# Altium schematic sheet Functional Diagram.SchDoc: Functional Diagram
size A4; ApprovedBy: LD Stanton; Author: LD Stanton; CompanyName: University of Cape Town; DrawnBy: Lawrence Stanton; Engineer: Lawrence Stanton; Organization: University of Cape Town; Address1: Department of Electrical Engineering; Address2: Rondebosch; Address3: Cape Town; Address4: South Africa 7701; DocumentNumber: 2; SheetNumber: 2; SheetTotal: 4
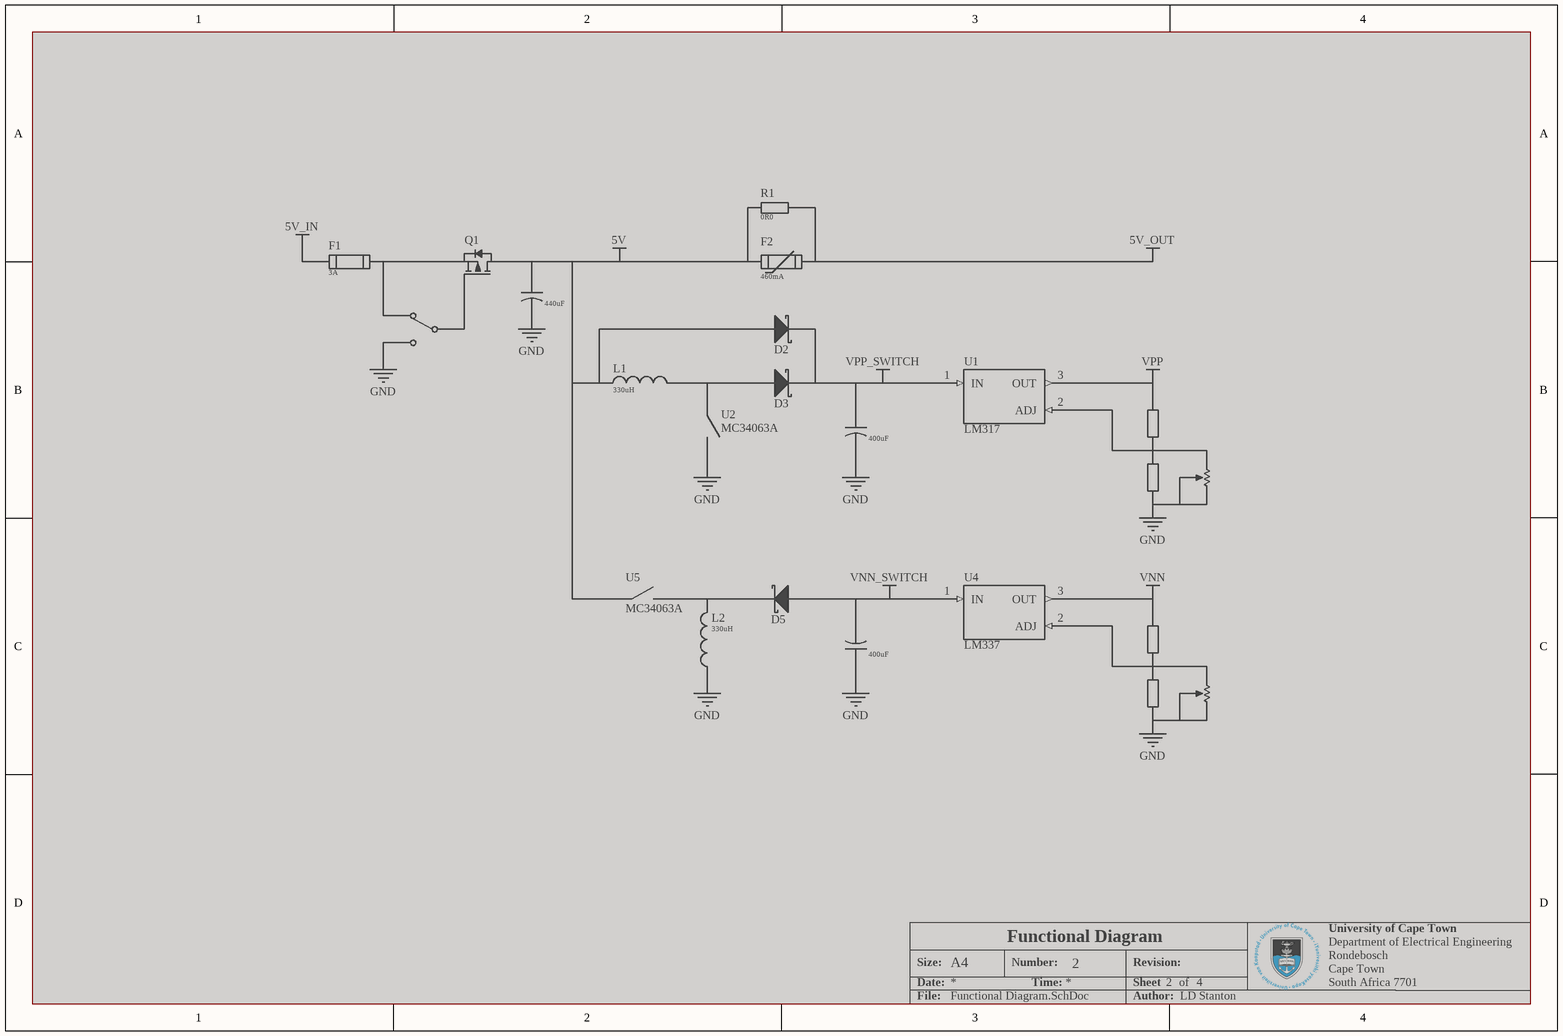
[diagram p0: Functional Diagram.SchDoc]

## Parts
(Parts that share a designator on the sheet are numbered #1, #2 ... from top to bottom, then left to right.)
C?#1  value 440uF  (hidden comment: Capacitor Polarised Illustration)  (graphical)  (masked out: inside a compile mask, not in the netlist)
C?#2  value 400uF  (hidden comment: Capacitor Polarised Illustration)  (graphical)  (masked out: inside a compile mask, not in the netlist)
C?#3  value 400uF  (hidden comment: Capacitor Polarised Illustration)  (graphical)  (masked out: inside a compile mask, not in the netlist)
D2  Schottky Diode Illustration  (value not drawn)  (graphical)  (masked out: inside a compile mask, not in the netlist)
D3  Schottky Diode Illustration  (value not drawn)  (graphical)  (masked out: inside a compile mask, not in the netlist)
D5  Schottky Diode Illustration  (value not drawn)  (graphical)  (masked out: inside a compile mask, not in the netlist)
F1  Current: 3A  (hidden comment: Fuse Illustration IEC)  (graphical)  (masked out: inside a compile mask, not in the netlist)
F2  Current: 460mA  (hidden comment: Fuse PTC Illustration IEC)  (graphical)  (masked out: inside a compile mask, not in the netlist)
L1  value 330uH  (hidden comment: Inductor Illustration)  (graphical)  (masked out: inside a compile mask, not in the netlist)
L2  value 330uH  (hidden comment: Inductor Illustration)  (graphical)  (masked out: inside a compile mask, not in the netlist)
Q1  MOSFET P-Channel Illustration  (value not drawn)  (graphical)  (masked out: inside a compile mask, not in the netlist)
R1  value 0R0  (hidden comment: Resistor Box Illustration)  (graphical)  (masked out: inside a compile mask, not in the netlist)
R?#1  Resistor Box Illustration  (value not drawn)  (graphical)  (masked out: inside a compile mask, not in the netlist)
R?#2  Resistor Box Illustration  (value not drawn)  (graphical)  (masked out: inside a compile mask, not in the netlist)
R?#3  Potentiometer Illustration  (value not drawn)  (graphical)  (masked out: inside a compile mask, not in the netlist)
R?#4  Resistor Box Illustration  (value not drawn)  (graphical)  (masked out: inside a compile mask, not in the netlist)
R?#5  Resistor Box Illustration  (value not drawn)  (graphical)  (masked out: inside a compile mask, not in the netlist)
R?#6  Potentiometer Illustration  (value not drawn)  (graphical)  (masked out: inside a compile mask, not in the netlist)
SW?  Switch Double Throw Toggling Illustration  (value not drawn)  (graphical)  (masked out: inside a compile mask, not in the netlist)
U1  LM317  (graphical)  (masked out: inside a compile mask, not in the netlist)
U2  MC34063A  (graphical)  (masked out: inside a compile mask, not in the netlist)
U4  LM337  (graphical)  (masked out: inside a compile mask, not in the netlist)
U5  MC34063A  (graphical)  (masked out: inside a compile mask, not in the netlist)

## Notes on the sheet
- Size:
- Date:
- A4
- Number:
- Time:
- Revision:
- Sheet
- of
- File:
- Author:

## Library data of the parts
C?#1-C?#3 = CMP-000004-7: Polarised Capacitor for Illustration; Placement: CRITICAL; Tolerance: ±0%; Voltage: 0V; Temperature Coefficient: ±0ppm/K; Package: 0000; Temperature: -0 - 0°C
D2 D3 D5 = CMP-00003-4: Schottky Diode for Ilustration; Blocking Voltage: 0V0; Forward Current: 0A0; Placement: CRITICAL; Temperature: -0 - 0°C; Forward Voltage: 0V0
F1 = CMP-000005-8: IEC Style Fuse for Illustration; Placement: CRITICAL; Resistance: 0K0; Voltage: 0V; Package: 0000; Temperature: -0 - 0°C
F2 = CMP-000006-7: IEC Style PTC Fuse for Illustration; Placement: CRITICAL; Resistance: 0K0; Voltage: 0V; Package: 0000; Temperature: -0 - 0°C
L1 L2 = CMP-000009-4: General Inductor for Illustration; Rated Current: 0A; Tolerance: ±0%; Temperature Coefficient: ±0ppm/K; Placement: CRITICAL; Resistance: 0K0; Temperature: -0 - 0°C; Saturation Current: 0A
Q1 = CMP-00001-3: P-Channel MOSFET 3-Terminal for Illustration; Drain-Source Voltage: 0V; Current: 0A; Placement: CRITICAL; Temperature: -0 - 0°C; Gate Threshold Voltage: 0V; Gate-Source Voltage: 0V
R1 = CMP-010-000360-14: Resistor for Illustration. Box Symbol.; Working Voltage: 0V; Power: 0W; Placement: CRITICAL; Tolerance: ±0%; Temperature Coefficient: ±0ppm/K; Package: 0000; Temperature: -0 - 0°C
R?#1 R?#2 R?#4 R?#5 = CMP-010-000360-14: Resistor for Illustration. Box Symbol.; Value: 0K0; Working Voltage: 0V; Power: 0W; Placement: CRITICAL; Tolerance: ±0%; Temperature Coefficient: ±0ppm/K; Package: 0000; Temperature: -0 - 0°C
R?#3 R?#6 = CMP-010-000362-3: Potentiometer for Illustration.; Value: 0K0; Working Voltage: 0V; Placement: CRITICAL; Power: 0W; Temperature Coefficient: ±0ppm/K; Tolerance: ±0%; Temperature: -0 - 0°C
SW? = CMP-00006-1: Double Throw Toggling Switch for Illustration; Current: 0A; Placement: CRITICAL; Voltage: 0V; Temperature: -0 - 0°C
U1 U4 = CMP-000013-1: Adjustible Linear Regulator for Illustration
U2 U5 = CMP-000007-9: Single Throw General Switch for Illustration; Placement: CRITICAL; Current: 0A; Voltage: 0V; Temperature: -0 - 0°C